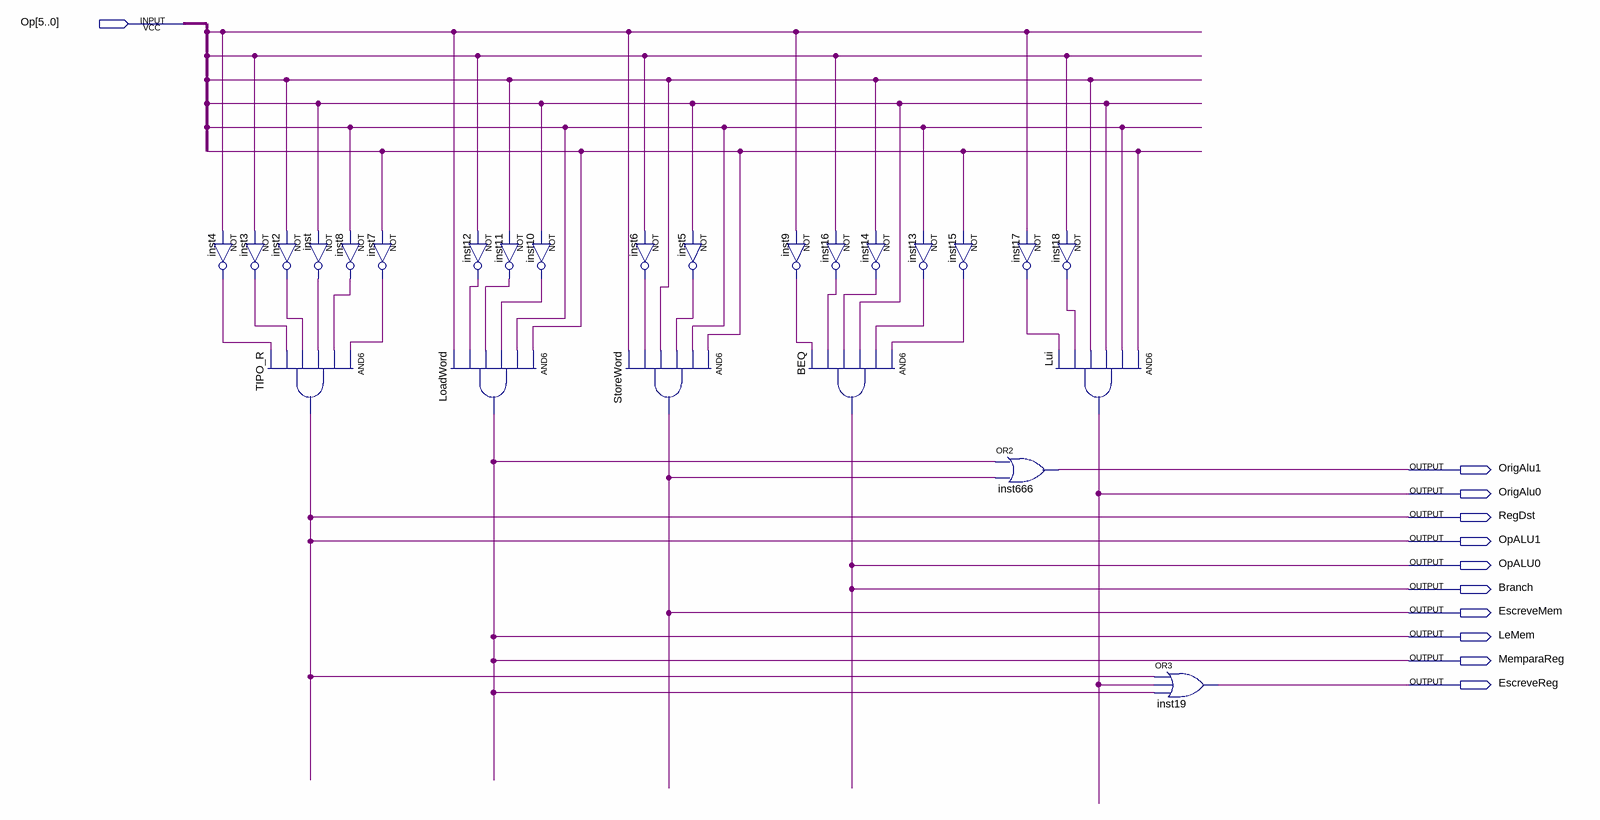
[diagram p0: schematic sheet]
// Quartus schematic Controle.bdf as structural Verilog: 25 symbols, 11 pins
module Controle (
  input  [5:0] Op,
  output OrigAlu1,
  output OrigAlu0,
  output RegDst,
  output OpALU1,
  output OpALU0,
  output Branch,
  output EscreveMem,
  output LeMem,
  output MemparaReg,
  output EscreveReg
);

  wire inst2_out, inst3_out, inst4_out, inst5_out, inst6_out, inst7_out, inst8_out, inst9_out, inst10_out,
       inst11_out, inst12_out, inst13_out, inst14_out, inst15_out, inst16_out, inst17_out, inst18_out,
       inst_out;

  not inst4 (inst4_out, Op[5]);
  not inst2 (inst2_out, Op[3]);
  not inst3 (inst3_out, Op[4]);
  and TIPO_R (OpALU1, inst7_out, inst8_out, inst_out, inst2_out, inst3_out, inst4_out);
  not inst (inst_out, Op[2]);
  not inst8 (inst8_out, Op[1]);
  not inst7 (inst7_out, Op[0]);
  not inst12 (inst12_out, Op[4]);
  and LoadWord (LeMem, Op[0], Op[1], inst10_out, inst11_out, inst12_out, Op[5]);
  not inst10 (inst10_out, Op[2]);
  not inst11 (inst11_out, Op[3]);
  not inst6 (inst6_out, Op[4]);
  and StoreWord (EscreveMem, Op[0], Op[1], inst5_out, Op[3], inst6_out, Op[5]);
  not inst5 (inst5_out, Op[2]);
  not inst9 (inst9_out, Op[5]);
  not inst16 (inst16_out, Op[4]);
  and BEQ (Branch, inst15_out, inst13_out, Op[2], inst14_out, inst16_out, inst9_out);
  not inst13 (inst13_out, Op[1]);
  not inst14 (inst14_out, Op[3]);
  not inst15 (inst15_out, Op[0]);
  not inst17 (inst17_out, Op[5]);
  and Lui (OrigAlu0, Op[0], Op[1], Op[2], Op[3], inst18_out, inst17_out);
  or inst666 (OrigAlu1, LeMem, EscreveMem);
  not inst18 (inst18_out, Op[4]);
  or inst19 (EscreveReg, OpALU1, OrigAlu0, LeMem);

  assign MemparaReg = LeMem;
  assign OpALU0 = Branch;
  assign RegDst = OpALU1;
endmodule
